# EAGLE schematic controller (EAGLE 9.6.2)
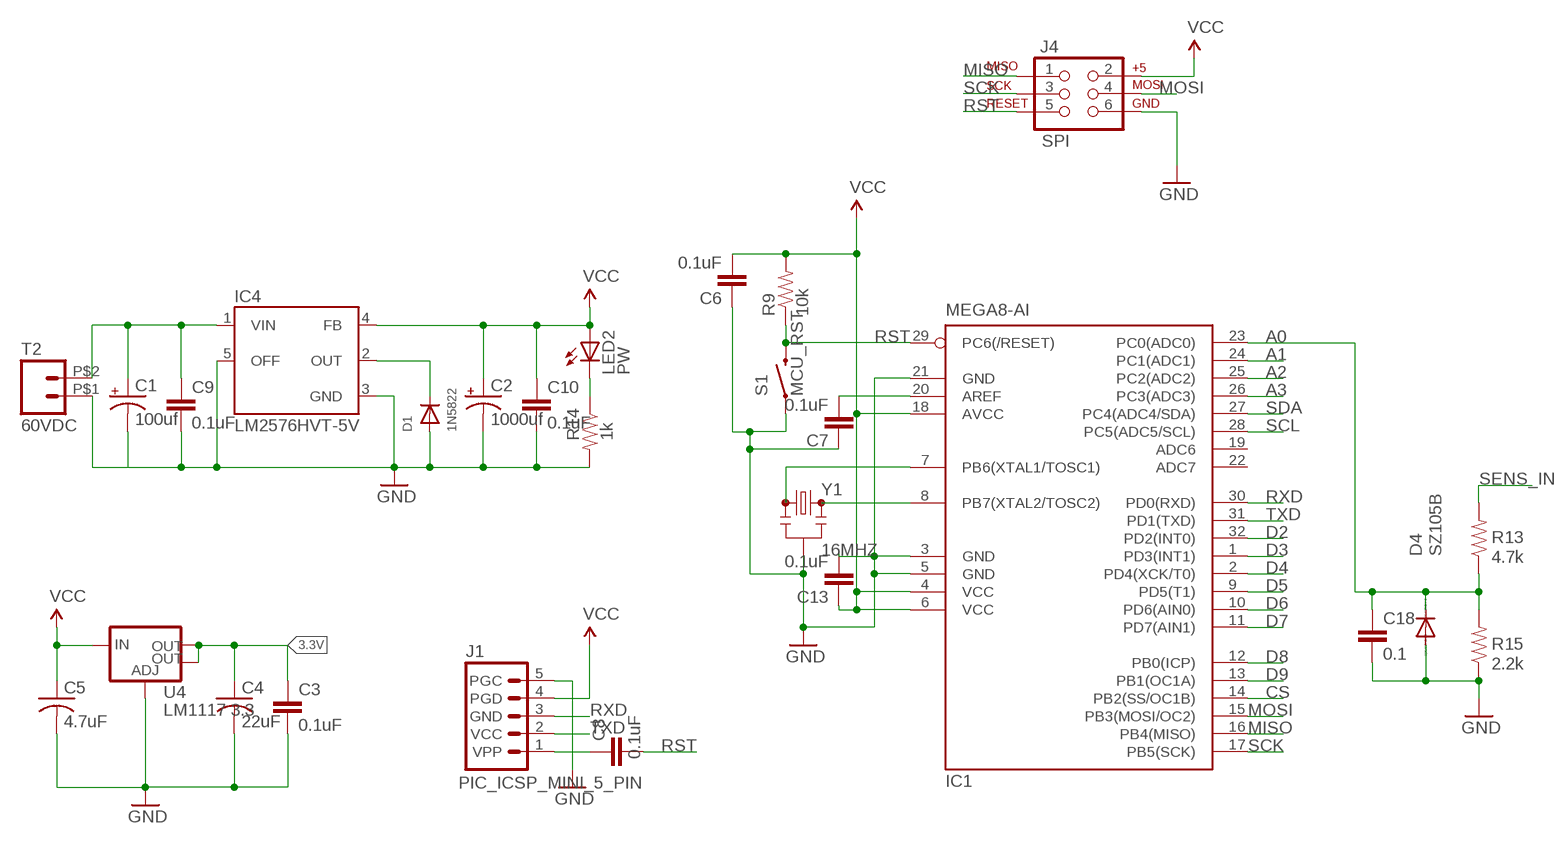
[diagram p0: schematic, sheet 1]

## Parts
C1  100uf  CPOL-US153CLV-1010  [153CLV-1010]
C2  1000uf  CPOL-US153CLV-1010  [153CLV-1010]
C3  0.1uF  CAP0805  [0805]
C4  22uF  C-USC1206  [C1206]
C5  4.7uF  C-USC1206  [C1206]
C6  0.1uF  CAP0805  [0805]
C7  0.1uF  CAP0805  [0805]
C8  0.1uF  CAP0805  [0805]
C9  0.1uF  CAP0805  [0805]
C10  0.1uF  CAP0805  [0805]
C13  0.1uF  CAP0805  [0805]
C18  0.1  CAP0805  [0805]
D1  1N5822  DIODE_SOD-123FL  [SOD-123FL]
D4  SZ105B  DIODE-DO-214AC  [DO-214AC]
IC1  MEGA8-AI  [TQFP32-08]
IC4  LM2576HVT-5V  LM2576S  [TO263-5]
J1  PIC_ICSP_MINI_5_PIN  [PIC_ICSP_MINI_5_PIN]
J4  SPI  AVR_SPI_PRG_6PTH  [2X3]
LED2  PW  LED3MM  [LED3MM]
R9  10k  RESISTOR0805-RES  [0805]
R13  4.7k  RESISTOR0805-RES  [0805]
R14  1k  RESISTOR0805-RES  [0805]
R15  2.2k  RESISTOR0805-RES  [0805]
S1  MCU_RST  SWITCH-MOMENTARY-2SMD-1101NE  [TACTILE-SWITCH-1101NE]
T2  60VDC  ST02-3.5MM  [ED350V-02P]
U4  LM1117 3.3  V_REG_LM1117SOT223  [SOT223]
Y1  16MHZ  RESONATOR16MHZ  [RESONATOR-SMD]

## Nets
3.3V: C3.1 C4.1 U4.2(OUT) U4.4(OUT)
A0: C18.1 D4.C IC1.23(PC0(ADC0)) R13.1 R15.2
A1: IC1.24(PC1(ADC1))
A2: IC1.25(PC2(ADC2))
A3: IC1.26(PC3(ADC3))
CS: IC1.14(PB2(SS/OC1B))
D2: IC1.32(PD2(INT0))
D3: IC1.1(PD3(INT1))
D4: IC1.2(PD4(XCK/T0))
D5: IC1.9(PD5(T1))
D6: IC1.10(PD6(AIN0))
D7: IC1.11(PD7(AIN1))
D8: IC1.12(PB0(ICP))
D9: IC1.13(PB1(OC1A))
GND: C1.- C2.- C3.2 C4.2 C5.2 C6.1 C7.1 C9.2 C10.2 C13.2 C18.2 D1.A D4.A IC1.3(GND) IC1.5(GND) IC1.21(GND) IC4.3(GND) IC4.5(OFF) J1.5(PGC) J4.6 R14.2 R15.1 S1.1 T2.P$1 U4.1(ADJ) Y1.2
MISO: IC1.16(PB4(MISO)) J4.1
MOSI: IC1.15(PB3(MOSI/OC2)) J4.4
N$1: C1.+ C9.1 IC4.1(VIN) T2.P$2
N$2: D1.C IC4.2(OUT)
N$5: IC1.8(PB7(XTAL2/TOSC2)) Y1.3
N$7: IC1.7(PB6(XTAL1/TOSC1)) Y1.1
N$8: C7.2 IC1.20(AREF)
N$9: C8.1 J1.1(VPP)
N$12: LED2.K(C) R14.1
RST: C8.2 IC1.29(PC6(/RESET)) J4.5 R9.1 S1.2
RXD: IC1.30(PD0(RXD)) J1.3(GND)
SCK: IC1.17(PB5(SCK)) J4.3
SCL: IC1.28(PC5(ADC5/SCL))
SDA: IC1.27(PC4(ADC4/SDA))
SENS_IN: R13.2
TXD: IC1.31(PD1(TXD)) J1.2(VCC)
VCC: C2.+ C5.1 C6.2 C10.1 C13.1 IC1.4(VCC) IC1.6(VCC) IC1.18(AVCC) IC4.4(FB) J1.4(PGD) J4.2 LED2.A R9.2 U4.3(IN)
Unconnected: IC1.19(ADC6) IC1.22(ADC7)

## Library data of the parts
C1 C2 = adafruit:CPOL-US: POLARIZED CAPACITOR, American symbol
C3 C6-C10 C13 C18 = SparkFun-Passives:CAP: Capacitor Standard 0603 ceramic capacitor, and 0.1" leaded capacitor.
C4 C5 = adafruit:C-US: CAPACITOR, American symbol
D1 = adafruit:DIODE: Diode SMADIODE - SMA Surface Mount Package 20V 1A Schottky Diode Digikey: 641-1014-6-ND DO-1N4148 - Through Hole Small Current Diode SOD-123 20V 1 A (.5mV Vf) Schottky Diode - Digikey: MBRX120TPMSCT-ND SOD-323 10V 570mA (.38mV Vf, 3ns) Schottky Diode - Digikey: ZLLS410CT-ND SOD-523 30V 30mA Schottky Diode (RB751S-40TE61) - Digikey: RB751S-40TE61CT-ND SOT23-R/W - SOT23 Package (R = Solder Paste/Reflow Ovens, W = Hand-Soldering) BAT54Film 40V 300mA - Digikey: 497-7162-1-ND
D4 = diode:DIODE-: DIODE
IC1 = atmel:MEGA8: MICROCONTROLLER 8 Kbytes FLASH, 1 kbytes SRAM, 512 bytes EEPROM, USART, 6-channel 10 bit ADC, 2-channel 8 bit ADC Pin compatible with Atmega48, ATMega88, ATMega168 Source: avr.lbr; MPN: ATMEGA8-16AU; OC_FARNELL: 9171371; OC_NEWARK: 73M8863
IC4 = v-reg-3:LM2576: National Semiconductor <http://www.national.com> 3.0A "Simple Switcher"(c) 52kHz, Vout 1.23-37V (HV: 57V), Vin 40V (HV: 60V), 50µA standby current
J1 = SparkFun-Connectors:PIC_ICSP_MINI_5_PIN: PIC-ICSP-Mini Miniature 5-pin connection for temporary programming of PICs. Use this device in your design to save space. Miniature ISCP Programming connector for PICs This 5 pin header contains all the lines necessary for programming most PIC microcontrollers. Use this device in your design to save space. Here is the connector we sell at SparkFun: 5-Pin Mini ICSP Connector <https://www.sparkfun.com/products/11264> (PRT-11264) It is used on these SparkFun products: USB Bit Whacker - 18F2553 Development Board <https://www.sparkfun.com/products/762> (DEV-00762) SparkFun Serial Enabled LCD Backpack <https://www.sparkfun.com/products/258> (LCD-00258) Also, if you need a nice PIC programmer, please check these out: MPLAB PICkit 3 <https://www.sparkfun.com/products/9973> (PGM-09973); PROD_ID: CONN-08314; SF_ID: PRT-11264
J4 = SparkFun-Connectors:AVR_SPI_PRG_6: AVR ISP 6 Pin This is the reduced ISP connector for AVR programming. Common on Arduino. This footprint will take up less PCB space and can be used with a 10-pin to 6-pin adapter such as SKU: BOB-08508 **Special note about "TEST_POINT" package. The stop mask is on the top side, so if you want your programming test points to be on the bottom of your board, make sure to place this package on the bottom side of the board. This also ensure that the orientation to program from the bottom side will be correct.
LED2 = adafruit:LED: LED OSRAM: - CHIPLED LG R971, LG N971, LY N971, LG Q971, LY Q971, LO R971, LY R971 LH N974, LH R974 LS Q976, LO Q976, LY Q976 LO Q996 - Hyper CHIPLED LW Q18S LB Q993, LB Q99A, LB R99A - SideLED LS A670, LO A670, LY A670, LG A670, LP A670 LB A673, LV A673, LT A673, LW A673 LH A674 LY A675 LS A676, LA A676, LO A676, LY A676, LW A676 LS A679, LY A679, LG A679 - Hyper Micro SIDELED® LS Y876, LA Y876, LO Y876, LY Y876 LT Y87S - SmartLED LW L88C, LW L88S LB L89C, LB L89S, LG L890 LS L89K, LO L89K, LY L89K LS L896, LA L896, LO L896, LY L896 - TOPLED LS T670, LO T670, LY T670, LG T670, LP T670 LSG T670, LSP T670, LSY T670, LOP T670, LYG T670 LG T671, LOG T671, LSG T671 LB T673, LV T673, LT T673, LW T673 LH T674 LS T676, LA T676, LO T676, LY T676, LB T676, LH T676, LSB T676, LW T676 LB T67C, LV T67C, LT T67C, LS T67K, LO T67K, LY T67K, LW E67C LS E67B, LA E67B, LO E67B, LY E67B, LB E67C, LV E67C, LT E67C LW T67C LS T679, LY T679, LG T679 LS T770, LO T770, LY T770, LG T770, LP T770 LB T773, LV T773, LT T773, LW T773 LH T774 LS E675, LA E675, LY E675, LS T675 LS T776, LA T776, LO T776, LY T776, LB T776 LHGB T686 LT T68C, LB T68C - Hyper Mini TOPLED® LB M676 - Mini TOPLED Santana® LG M470 LS M47K, LO M47K, LY M47K Source: http://www.osram.convergy.de/
R9 R13-R15 = SparkFun-Resistors:RESISTOR: Resistor Basic schematic elements and footprints for 0603, 1206, and PTH resistors.
S1 = SparkFun-Electromechanical:SWITCH-MOMENTARY-2: Various NO switches- pushbuttons, reed, etc; PROD_ID: SWCH-00815
T2 = con-dinkle:ST02: Dinkle® Screw Terminal Block - 2 Way -5MM: EK500V series. Rated at 20A, 300VAC. Cable size: 2mm² Supplier: Altronics P2034A Source: http://www.dinkle.com/upfiles/proter21253708953.pdf -5.08MM: The back half of a EK500V4R-04P. Rated at 20A, 300VAC. Cable size: 2mm² Supplier: Altronics P2024 (half of) Source: http://www.dinkle.com/upfiles/proter21253708833.pdf -3.5MM: ED350V series. Rated at 10A, 300VAC. Cable size: 1.4mm² Supplier: Altronics P2028 Source: http://www.dinkle.com/upfiles/proter21253714491.pdf
U4 = SparkFun-PowerIC:V_REG_LM1117: Voltage Regulator LM1117 Standard adjustable voltage regulator but in SMD form. Spark Fun Electronics SKU : COM-00595; PROD_ID: VREG-08170
Y1 = SparkFun-FreqCtrl:RESONATOR: Resonator Small SMD resonator. Used, eg, on the Arduino Pro/ Pro Mini boards. 8MHz- XTAL-08895 16MHz- XTAL-08900; PROD_ID: XTAL-08900